# Altium schematic sheet CH340G.SchDoc
size A4
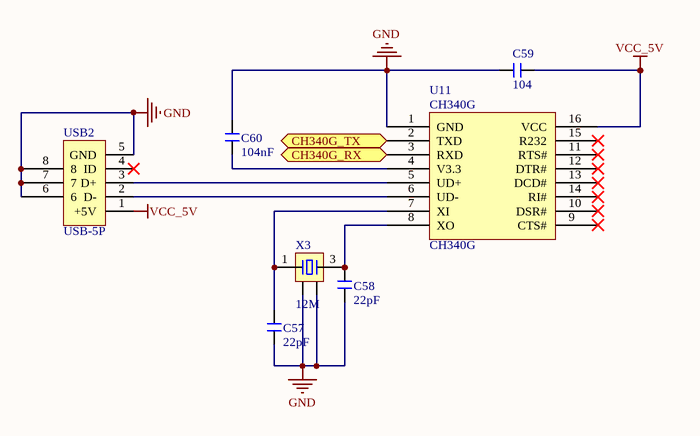
[diagram p0: CH340G.SchDoc]

## Parts
C57  22pF  [0603_C]
C58  22pF  [0603_C]
C59  104  [0603_C]
C60  104nF  [0603_C]
U11  CH340G  [SOIC-16_150mil]
USB2  USB-5P  [micro_usb_47589]
X3  12M  [SMD-3225_4P]

## Ports
CH340G_RX (bidir), CH340G_TX (bidir)

## Nets
GND: C57.2 C58.2 C59.1 C60.2 U11.1(GND) USB2.5(GND) USB2.6 USB2.7 USB2.8 X3.2 X3.4
VCC_5V: C59.2 U11.16(VCC) USB2.1(+5V)
CH340G_RX: U11.3(RXD) ; port CH340G_RX
CH340G_TX: U11.2(TXD) ; port CH340G_TX
NetC57_1: C57.1 U11.7(XI) X3.1
NetC58_1: C58.1 U11.8(XO) X3.3
NetC60_1: C60.1 U11.4(V3.3)
NetU11_5: U11.5(UD+) USB2.3(D+)
NetU11_6: U11.6(UD-) USB2.2(D-)

Not connected (* = marked no-connect by the designer): U11 9(CTS#)* 10(DSR#)* 11(RTS#)* 12(DTR#)* 13(DCD#)* 14(RI#)* 15(R232)*; USB2 4(ID)*

## Library data of the parts
C57-C60 = C: 无极性贴片电容
U11 = CH340G: USB; ComponentLink1Description: 供应商链接; ComponentLink1URL: http://www.szlcsc.com/product/details_14927.html; Package: SOIC-16_150mil; Supplier: LC; SuppliersPartNumber: C14267
USB2 = USB-5P: 微型USB母座; 版权归属: 源创客; BOM名称: 微型USB母座; 学习资源: www.ooocke.com
X3 = XTAL-4P: 4脚无源晶振